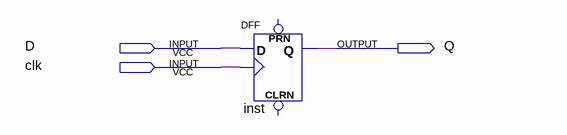
[diagram p0: schematic sheet]
// Quartus schematic D_FF.bdf as structural Verilog: 1 symbols, 3 pins
module D_FF (
  input  D,
  input  clk,
  output Q
);

  DFF inst (.CLK(clk), .D(D), .Q(Q));  // open: CLRN, PRN
endmodule
